# EAGLE design untitled (EAGLE 9.6.2)
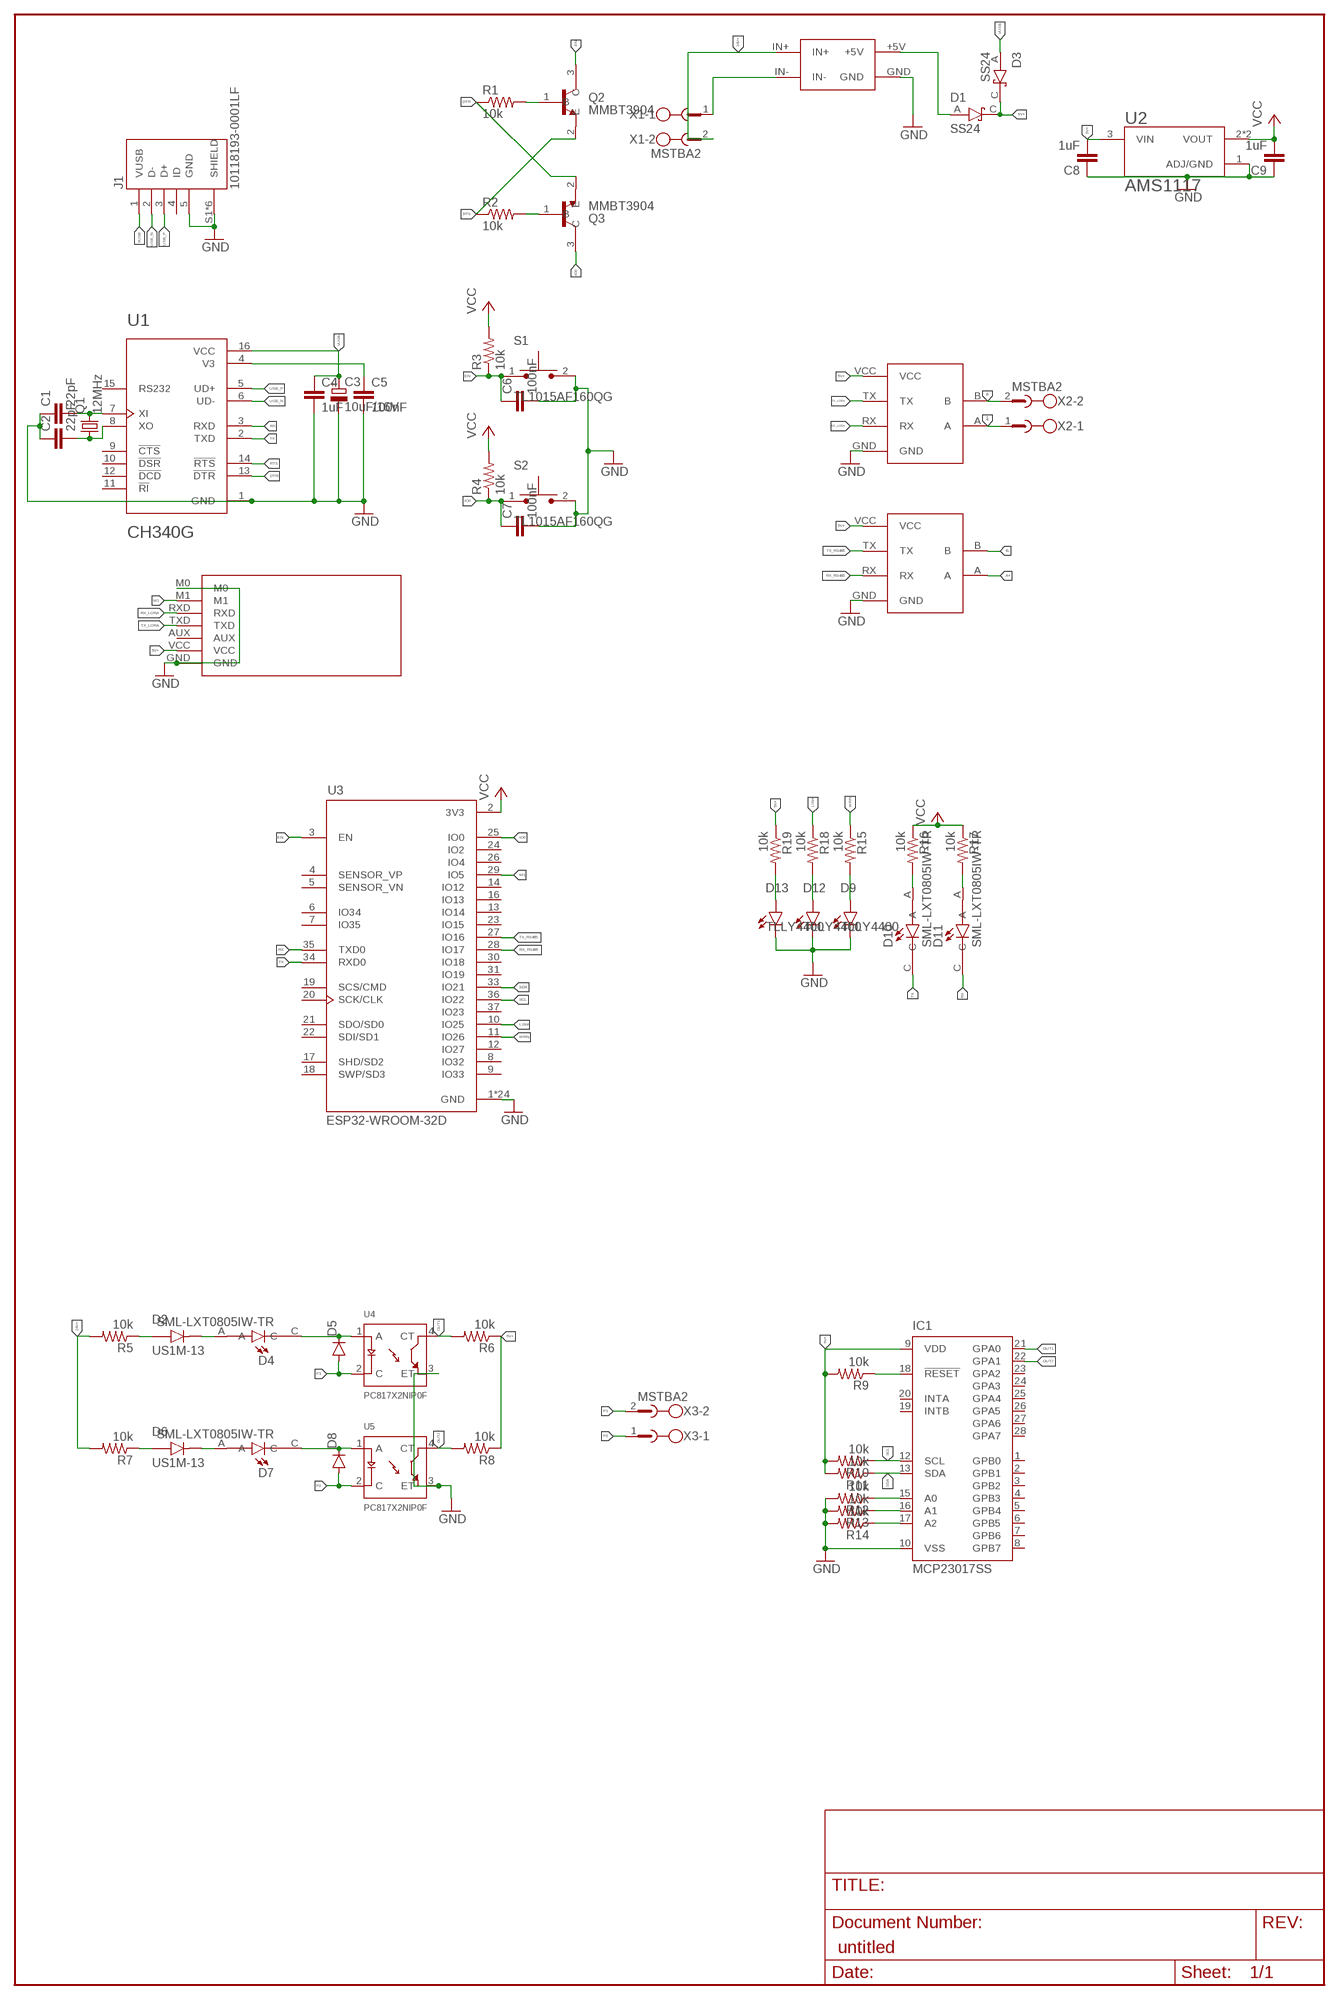
[diagram p0: schematic, sheet 1]

## Parts
C1  22pF  C-EUC0805K  [C0805K]
C2  22pF  C-EUC0805K  [C0805K]
C3  10uF/16V  CPOL-EU153CLV-0505  [153CLV-0505]
C4  1uF  C-EUC0805K  [C0805K]
C5  100nF  C-EUC0805K  [C0805K]
C6  100nF  C-EUC0805K  [C0805K]
C7  100nF  C-EUC0805K  [C0805K]
C8  1uF  C-EUC0805K  [C0805K]
C9  1uF  C-EUC0805K  [C0805K]
D1  SS24  [DIOM5336X265N]
D2  US1M-13  [DIOM5226X240N]
D3  SS24  [DIOM5336X265N]
D4  SML-LXT0805IW-TR  [LEDC2012X120N]
D5  DIODE-SOD123  [SOD123]
D6  US1M-13  [DIOM5226X240N]
D7  SML-LXT0805IW-TR  [LEDC2012X120N]
D8  DIODE-SOD123  [SOD123]
D9  TLLY4400  [LED3MM]
D10  SML-LXT0805IW-TR  [LEDC2012X120N]
D11  SML-LXT0805IW-TR  [LEDC2012X120N]
D12  TLLY4400  [LED3MM]
D13  TLLY4400  [LED3MM]
EBYTEE220-900T22D1  EBYTEE220-900T22D  [EBYTEE220-900T22D]
IC1  MCP23017SS  [SSOP28]
J1  10118193-0001LF  [FCI_10118193-0001LF]
Q1  12MHz  CRYSTALSM49  [SM49]
Q2  MMBT3904  [SOT95P240X120-3N]
Q3  MMBT3904  [SOT95P240X120-3N]
R1  10k  R-US_M0805  [M0805]
R2  10k  R-US_M0805  [M0805]
R3  10k  R-US_M0805  [M0805]
R4  10k  R-US_M0805  [M0805]
R5  10k  R-US_0207/12  [0207/12]
R6  10k  R-US_M0805  [M0805]
R7  10k  R-US_0207/12  [0207/12]
R8  10k  R-US_M0805  [M0805]
R9  10k  R-US_M0805  [M0805]
R10  10k  R-US_M0805  [M0805]
R11  10k  R-US_M0805  [M0805]
R12  10k  R-US_M0805  [M0805]
R13  10k  R-US_M0805  [M0805]
R14  10k  R-US_M0805  [M0805]
R15  10k  R-US_M0805  [M0805]
R16  10k  R-US_M0805  [M0805]
R17  10k  R-US_M0805  [M0805]
R18  10k  R-US_M0805  [M0805]
R19  10k  R-US_M0805  [M0805]
S1  TL1015AF160QG  [SW_TL1015AF160QG]
S2  TL1015AF160QG  [SW_TL1015AF160QG]
SUPER-STEPDOWN1  SUPER-STEPDOWN  [SUPER-STEPDOWN]
TTL-RS1  TTL-RS485  [TTL-RS485]
TTL-RS2  TTL-RS485  [TTL-RS485]
U1  CH340G  [SOIC127P600X180-16N]
U2  AMS1117  [SOT229P700X180-4N]
U3  ESP32-WROOM-32D  [MODULE_ESP32-WROOM-32D]
U4  PC817X2NIP0F  [SOT254P975X400-4N]
U5  PC817X2NIP0F  [SOT254P975X400-4N]
X1  MSTBA2  [MSTBA2]
X2  MSTBA2  [MSTBA2]
X3  MSTBA2  [MSTBA2]

## Nets
5V+: C8.2 D1.C(K) D3.C(K) EBYTEE220-900T22D1.VCC IC1.9(VDD) R6.1 R8.1 R9.2 R10.2 R11.2 R19.1 TTL-RS1.VCC TTL-RS2.VCC U2.3(VIN)
24V+: R5.2 R7.2 SUPER-STEPDOWN1.IN+ X1.2
A+: TTL-RS1.A TTL-RS2.A X2.1
B-: TTL-RS1.B TTL-RS2.B X2.2
DTR: Q3.2(E) R1.1 U1.13(!DTR)
EN: C6.1 Q2.3(C) R3.1 S1.1 U3.3(EN)
GND: C1.1 C2.1 C3.- C4.2 C5.2 C6.2 C7.2 C8.1 C9.1 D9.K(C) D12.K(C) D13.K(C) EBYTEE220-900T22D1.GND EBYTEE220-900T22D1.M0 IC1.10(VSS) J1.5(GND) J1.S1(SHIELD) J1.S2(SHIELD) J1.S3(SHIELD) J1.S4(SHIELD) J1.S5(SHIELD) J1.S6(SHIELD) R12.2 R13.2 R14.2 S1.2 S2.2 SUPER-STEPDOWN1.GND TTL-RS1.GND TTL-RS2.GND U1.1(GND) U2.1(ADJ/GND) U3.1(GND) U3.15(GND) U3.38(GND) U3.39_1(GND) U3.39_2(GND) U3.39_3(GND) U3.39_4(GND) U3.39_5(GND) U3.39_6(GND) U3.39_7(GND) U3.39_8(GND) U3.39_9(GND) U3.39_10(GND) U3.39_11(GND) U3.39_12(GND) U3.39_13(GND) U3.39_14(GND) U3.39_15(GND) U3.39_16(GND) U3.39_17(GND) U3.39_18(GND) U3.39_19(GND) U3.39_20(GND) U3.39_21(GND) U4.3(ET) U5.3(ET)
IO0: C7.1 Q3.3(C) R4.1 S2.1 U3.25(IO0)
LINK: R18.1 U3.10(IO25)
M1: EBYTEE220-900T22D1.M1 U3.29(IO5)
N$1: SUPER-STEPDOWN1.IN- X1.1
N$2: C5.1 U1.4(V3)
N$3: Q2.1(B) R1.2
N$4: C1.2 Q1.2 U1.7(XI)
N$5: C2.2 Q1.1 U1.8(XO)
N$6: Q3.1(B) R2.2
N$7: D10.A R16.2
N$8: D1.A SUPER-STEPDOWN1.+5V
N$9: D2.A R5.1
N$10: D2.C(K) D4.A
N$11: D4.C D5.C U4.1(A)
N$12: IC1.15(A0) R12.1
N$13: IC1.16(A1) R13.1
N$14: IC1.17(A2) R14.1
N$15: D6.A R7.1
N$16: D6.C(K) D7.A
N$17: D7.C D8.C U5.1(A)
N$18: D11.A R17.2
N$19: D13.A R19.2
N$20: IC1.18(!RESET) R9.1
N$21: D12.A R18.2
N$22: D9.A R15.2
OUT1: IC1.21(GPA0) R6.2 U4.4(CT)
OUT2: IC1.22(GPA1) R8.2 U5.4(CT)
P1: D5.A U4.2(C) X3.2
P2: D8.A U5.2(C) X3.1
RTS: Q2.2(E) R2.1 U1.14(!RTS)
RX: D11.C U1.3(RXD) U3.35(TXD0)
RX_LORA: EBYTEE220-900T22D1.RXD TTL-RS1.RX
RX_RS485: TTL-RS2.RX U3.28(IO17)
SCL: IC1.12(SCL) R10.1 U3.36(IO22)
SDA: IC1.13(SDA) R11.1 U3.33(IO21)
TX: D10.C U1.2(TXD) U3.34(RXD0)
TX_LORA: EBYTEE220-900T22D1.TXD TTL-RS1.TX
TX_RS485: TTL-RS2.TX U3.27(IO16)
USB_N: J1.2(D-) U1.6(UD-)
USB_P: J1.3(D+) U1.5(UD+)
VCC: C9.2 R3.2 R4.2 R16.1 R17.1 U2.2(VOUT) U2.4(VOUT) U3.2(3V3)
VUSB: C3.+ C4.1 D3.A J1.1(VUSB) U1.16(VCC)
WRN: R15.1 U3.11(IO26)
Unconnected: EBYTEE220-900T22D1.AUX IC1.1(GPB0) IC1.2(GPB1) IC1.3(GPB2) IC1.4(GPB3) IC1.5(GPB4) IC1.6(GPB5) IC1.7(GPB6) IC1.8(GPB7) IC1.19(INTB) IC1.20(INTA) IC1.23(GPA2) IC1.24(GPA3) IC1.25(GPA4) IC1.26(GPA5) IC1.27(GPA6) IC1.28(GPA7) J1.4(ID) U1.9(!CTS) U1.10(!DSR) U1.11(!RI) U1.12(!DCD) U1.15(RS232) U3.4(SENSOR_VP) U3.5(SENSOR_VN) U3.6(IO34) U3.7(IO35) U3.8(IO32) U3.9(IO33) U3.12(IO27) U3.13(IO14) U3.14(IO12) U3.16(IO13) U3.17(SHD/SD2) U3.18(SWP/SD3) U3.19(SCS/CMD) U3.20(SCK/CLK) U3.21(SDO/SD0) U3.22(SDI/SD1) U3.23(IO15) U3.24(IO2) U3.26(IO4) U3.30(IO18) U3.31(IO19) U3.37(IO23)

## Library data of the parts
C1 C2 C4-C9 = rcl:C-EU: CAPACITOR, European symbol; SPICEPREFIX: C
C3 = rcl:CPOL-EU: POLARIZED CAPACITOR, European symbol; SPICEPREFIX: C
D1 D3 = SS24:SS24: Diode Schottky 40V 2A Surface Mount DO-214AA (SMB) Check availability <https://pricing.snapeda.com/parts/SS24/ON%20Semiconductor/view-part?ref=eda>; AVAILABILITY: In Stock; CHECK_PRICES: https://www.snapeda.com/parts/SS24/Onsemi/view-part/?ref=eda; DESCRIPTION: Diode Schottky 40V 2A Surface Mount DO-214AA (SMB); MF: ON Semiconductor; MP: SS24; PACKAGE: DO-214AA ON Semiconductor; PRICE: None; SNAPEDA_LINK: https://www.snapeda.com/parts/SS24/Onsemi/view-part/?ref=snap
D2 D6 = US1M-13:US1M-13: Diode, Fast Recovery, 1a, 1kv, Do-214ac-2, Full Reel Check availability <https://pricing.snapeda.com/parts/US1M-13/Diodes%20Incorporated/view-part?ref=eda>; AVAILABILITY: In Stock; DESCRIPTION: Diode Standard 1000 V 1A Surface Mount SMA; MF: Diodes Incorporated; MP: US1M-13; PACKAGE: DO-214AC-214 Diodes Incorporated; PRICE: None; PURCHASE-URL: https://pricing.snapeda.com/search/part/US1M-13/?ref=eda
D4 D7 D10 D11 = SML-LXT0805IW-TR:SML-LXT0805IW-TR: LED; Luminous Intensity:11µcd; Viewing Angle:140°; Forward Current:30mA; Forward Voltage:2V; Color:Red; LED Color:Red; Leaded Process Compatible:Yes; Lens Color:White; Mounting Type:Surface Mount ;RoHS Compliant: Yes Check availability <https://pricing.snapeda.com/parts/SML-LXT0805IW-TR/Lumex%20Opto/Components/view-part?ref=eda>; AVAILABILITY: In Stock; DESCRIPTION: Red - LED Indication - Discrete 2V 0805 (2012 Metric); MF: Lumex Opto/Components; MP: SML-LXT0805IW-TR; PACKAGE: 0805 Lumex; PRICE: None; PURCHASE-URL: https://pricing.snapeda.com/search/part/SML-LXT0805IW-TR/?ref=eda
D5 D8 = diode:DIODE-: DIODE
D9 D12 D13 = led:TLLY4400: Low Current (2mA) LED 3 mm Tinted Diffused Package color YELLOW Source: Data sheet <http://www.farnell.com/datasheets/391098.pdf>; MF: VISHAY SEMICONDUCTOR; OC_FARNELL: 1612439
EBYTEE220-900T22D1 = EByte E220-900T22D:EBYTEE220-900T22D
IC1 = microchip:MCP23017: http://ww1.microchip.com/downloads/en/DeviceDoc/21952a.pdf Source: http://ww1.microchip.com/downloads/en/DeviceDoc/21952a.pdf; MF: MICROCHIP; MPN: MCP23017-E/SS; OC_FARNELL: 1467674; OC_NEWARK: 31K2960
J1 = 10118193-0001LF:10118193-0001LF: Micro USB B Type Receptacle Check availability <https://pricing.snapeda.com/parts/10118193-0001LF/FCI/view-part?ref=eda>; AVAILABILITY: In Stock; DESCRIPTION: USB - micro B USB 2.0 Receptacle Connector 5 Position Surface Mount, Right Angle; Through Hole; MF: FCI; MP: 10118193-0001LF; PACKAGE: None; PRICE: None; PURCHASE-URL: https://pricing.snapeda.com/search/part/10118193-0001LF/?ref=eda
Q1 = crystal:CRYSTAL: CRYSTAL; OC_FARNELL: unknown; OC_NEWARK: unknown
Q2 Q3 = MMBT3904:MMBT3904: MMBT3904 Series 40 V CE Breakdown 0.2 A NPN General Purpose Amplifier - SOT-23 Check availability <https://pricing.snapeda.com/parts/MMBT3904/ON%20Semiconductor/view-part?ref=eda>; AVAILABILITY: In Stock; DESCRIPTION: Bipolar (BJT) Transistor NPN 40 V 200 mA 300MHz 300 mW Surface Mount SOT-23-3 (TO-236); MF: ON Semiconductor; MP: MMBT3904; PACKAGE: SOT-23-3 Motorola; PRICE: None
R1-R4 R6 R8-R19 = rcl:R-US_: RESISTOR, American symbol; SPICEPREFIX: R
R5 R7 = adafruit:R-US_: RESISTOR, American symbol
S1 S2 = TL1015AF160QG:TL1015AF160QG: Tactile Switch SPST-NO Top Actuated Surface Mount Check availability <https://pricing.snapeda.com/parts/TL1015AF160QG/E-Switch/view-part?ref=eda>; AVAILABILITY: In Stock; DESCRIPTION: Tactile Switch SPST-NO Top Actuated Surface Mount; MF: E-Switch; MP: TL1015AF160QG; PACKAGE: None; PRICE: None; PURCHASE-URL: https://pricing.snapeda.com/search/part/TL1015AF160QG/?ref=eda
SUPER-STEPDOWN1 = SUPER-STEPDOWN:SUPER-STEPDOWN
TTL-RS1 TTL-RS2 = TTL-RS485:TTL-RS485
U1 = CH340G:CH340G: Check availability <https://pricing.snapeda.com/parts/Ch340G/WCH/view-part?ref=eda>; AVAILABILITY: Not in stock; DESCRIPTION: USB Interface Integrated Circuit; MF: WCH; MP: Ch340G; PACKAGE: None; PRICE: None
U2 = AMS1117:AMS1117: Sot223/Pkg 1-Amp 5-Volt Low Drop Out Voltage Regulatator Check availability <https://pricing.snapeda.com/parts/AMS1117/Advanced%20Monolithic%20Systems/view-part?ref=eda>; AVAILABILITY: Not in stock; DESCRIPTION: 1A LOW DROPOUT VOLTAGE REGULATOR SOT-223; MF: Advanced Monolithic Systems; MP: AMS1117; PACKAGE: SOT-223 Seeed Technology; PRICE: None
U3 = ESP32-WROOM-32D:ESP32-WROOM-32D: Bluetooth, WiFi 802.11b/g/n, Bluetooth v4.2 + EDR, Class 1, 2 and 3 Transceiver Module 2.4GHz ~ 2.5GHz Integrated, Trace Surface Mount Check availability <https://pricing.snapeda.com/parts/ESP32-WROOM-32D/Espressif%20Systems/view-part?ref=eda>; AVAILABILITY: In Stock; DESCRIPTION: Bluetooth, WiFi 802.11b/g/n, Bluetooth v4.2 +EDR, Class 1, 2 and 3 Transceiver Module 2.4GHz ~ 2.5GHz Integrated; MF: Espressif Systems; MP: ESP32-WROOM-32D; PACKAGE: Module Espressif Systems; PRICE: None; PURCHASE-URL: https://pricing.snapeda.com/search/part/ESP32-WROOM-32D/?ref=eda
U4 U5 = PC817X2NIP0F:PC817X2NIP0F: PC817 Series 1 Channel 80 V 5000 Vrms General Purpose Photocoupler - DIP-4 Check availability <https://pricing.snapeda.com/parts/PC817X2NIP0F/Sharp%20Microelectronics/view-part?ref=eda>; AVAILABILITY: Not in stock; DESCRIPTION: Optoisolator Transistor Output 5000Vrms 1 Channel 4-SMD; MF: Sharp Microelectronics; MP: PC817X2NIP0F; PACKAGE: SMD-4 Sharp Microelectronics; PRICE: None
X1-X3 = con-phoenix-508:MSTBA2: PHOENIX; MF: FARNELL; MPN: 1757242; OC_FARNELL: 3705171; OC_NEWARK: 71C4161

## Board
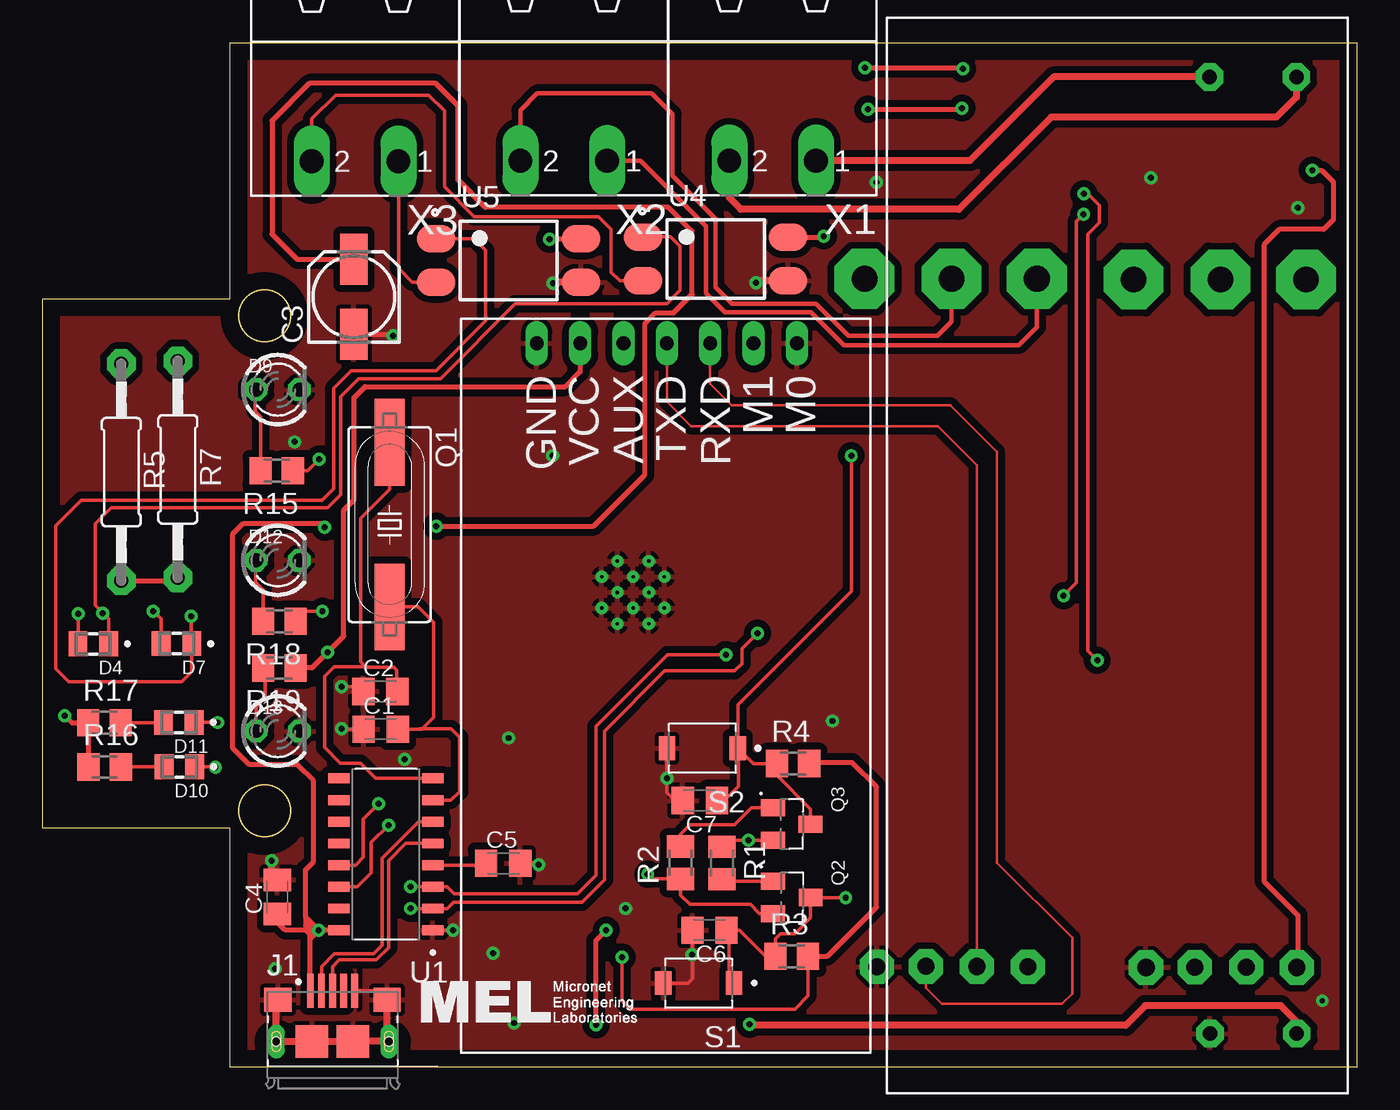
[diagram p1: board, top side]
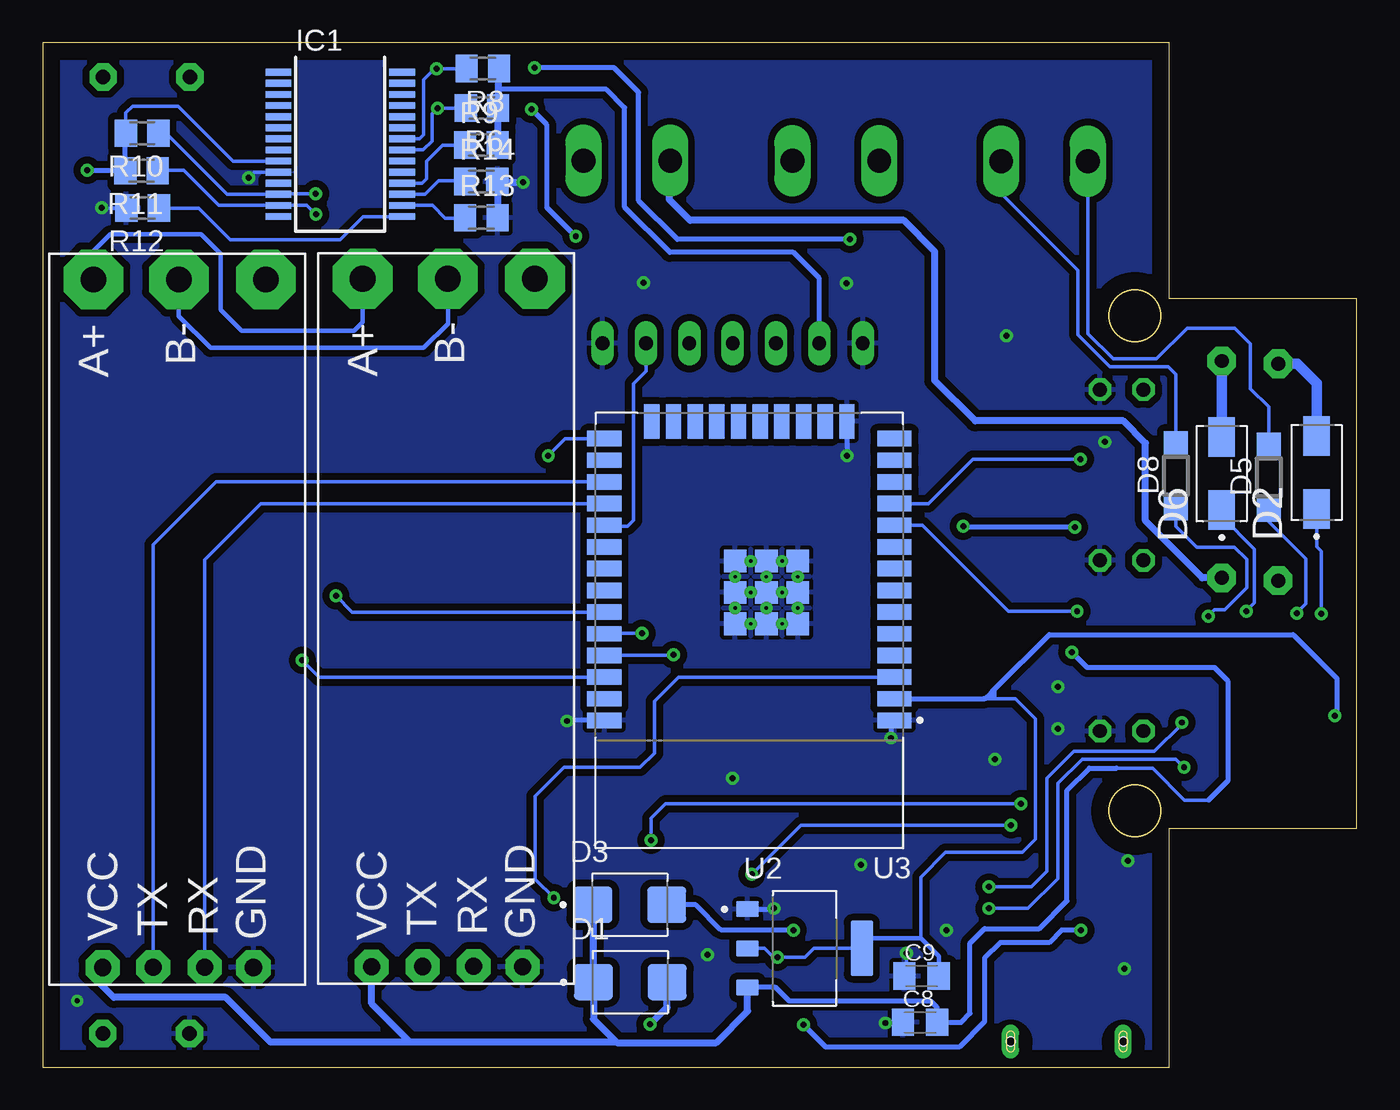
[diagram p2: board, bottom side, seen from below]

Size 77 x 60 mm. Coordinates in mm from the lower left corner, seen from the top.
Outline: 11,60 77,60 77,0 11,0 11,14 0,14 0,45 11,45 11,60
Outline: circle at 13,44 radius 1.5
Outline: circle at 13,15 radius 1.5
Copper layers (1*16): Top 0.035mm / dielectric 1.5mm / Bottom 0.035mm
Design rules "default": minimum track width 6mil, minimum drill 0.35mm, track to track 6mil, track to pad 6mil, pad to pad 6mil, via to via 6mil, smd to smd 6mil, copper to edge 40mil, drill to drill 6mil, minimum pad ring 10mil, minimum via ring 8mil, stop-mask expansion 4mil, vias tented up to drill 0mil, thermal gap 10mil

### Footprints (pad centres in the part's own frame; a part is rotated, then mirrored left to right if it is on the bottom)
C0805K = smd 1.3 x 1.6: 1 -1,0; 2 1,0
153CLV-0505 = smd 3 x 1.6: + 2.2,0; - -2.2,0
DIOM5336X265N = smd 2.29 x 2.12: A 2.16,0; C -2.16,0
DIOM5226X240N = smd 2.33 x 1.55: A 2.135,0; C -2.135,0
LEDC2012X120N = smd 1.1 x 1.45: A 0.9,0; C -0.9,0
SOD123 = smd 1.4 x 1.4: A 1.9,0; C -1.9,0
LED3MM = drill 0.813 octagon: A -1.27,0; K 1.27,0
EBYTEE220-900T22D = drill 0.8 pad 1.27 long: AUX -4.56,-10.98; GND -4.56,-16.06; M0 -4.56,-0.82; M1 -4.56,-3.36; RXD -4.56,-5.9; TXD -4.56,-8.44; VCC -4.56,-13.52
SSOP28 = smd 0.4 x 1.5: 1 -4.225,-3.625; 2 -3.575,-3.625; 3 -2.925,-3.625; 4 -2.275,-3.625; 5 -1.625,-3.625; 6 -0.975,-3.625; 7 -0.325,-3.625; 8 0.325,-3.625; 9 0.975,-3.625; 10 1.625,-3.625; 11 2.275,-3.625; 12 2.925,-3.625; 13 3.575,-3.625; 14 4.225,-3.625; 15 4.225,3.625; 16 3.575,3.625; 17 2.925,3.625; 18 2.275,3.625; 19 1.625,3.625; 20 0.975,3.625; 21 0.325,3.625; 22 -0.325,3.625; 23 -0.975,3.625; 24 -1.625,3.625; 25 -2.275,3.625; 26 -2.925,3.625; 27 -3.575,3.625; 28 -4.225,3.625
FCI_10118193-0001LF = smd 0.4 x 2: 1 -1.3,2.975; 2 -0.65,2.975; 3 0,2.975; 4 0.65,2.975; 5 1.3,2.975 | smd 1.6 x 1.4: S1 -3.2,2.45; S2 3.2,2.45 | smd 1.9 x 1.9: S3 1.2,0; S4 -1.2,0 | drill 0.5 pad 0.9 long: S5 -3.3,0; S6 3.3,0 | hole 0.5: -3.3,0; 3.3,0
SM49 = smd 5.08 x 1.778: 1 -4.826,0; 2 4.826,0
SOT95P240X120-3N = smd 1 x 1.4: 1 -0.95,-1.1; 2 0.95,-1.1; 3 0,1.1
M0805 = smd 1.3 x 1.6: 1 -0.95,0; 2 0.95,0
0207/12 = drill 0.813 pad 1.676 octagon: 1 -6.35,0; 2 6.35,0
SW_TL1015AF160QG = smd 0.95 x 1.4: 1 -2.075,0; 2 2.075,0
SUPER-STEPDOWN = drill 0.85 pad 1.6 octagon: +5V 59.509,24.006; GND 59.509,18.926; IN+ 3.478,23.979; IN- 3.478,18.899
TTL-RS485 = drill 1.5 pad 3.5 octagon: A -19.7,-6; B -19.7,-1; P$7 -19.7,4.1 | drill 1 pad 2 octagon: GND 20.6,3.37; RX 20.581,0.505; TX 20.583,-2.493; VCC 20.6,-5.47
SOIC127P600X180-16N = smd 1.31 x 0.62: 1 -2.75,4.445; 2 -2.75,3.175; 3 -2.75,1.905; 4 -2.75,0.635; 5 -2.75,-0.635; 6 -2.75,-1.905; 7 -2.75,-3.175; 8 -2.75,-4.445; 9 2.75,-4.445; 10 2.75,-3.175; 11 2.75,-1.905; 12 2.75,-0.635; 13 2.75,0.635; 14 2.75,1.905; 15 2.75,3.175; 16 2.75,4.445
SOT229P700X180-4N = smd 1.31 x 0.93: 1 -3.345,2.29; 2 -3.345,0; 3 -3.345,-2.29 | smd 1.31 x 3.24: 4 3.345,0
MODULE_ESP32-WROOM-32D = smd 2 x 0.9: 1 -8.5,5.26; 2 -8.5,3.99; 3 -8.5,2.72; 4 -8.5,1.45; 5 -8.5,0.18; 6 -8.5,-1.09; 7 -8.5,-2.36; 8 -8.5,-3.63; 9 -8.5,-4.9; 10 -8.5,-6.17; 11 -8.5,-7.44; 12 -8.5,-8.71; 13 -8.5,-9.98; 14 -8.5,-11.25; 25 8.5,-11.25; 26 8.5,-9.98; 27 8.5,-8.71; 28 8.5,-7.44; 29 8.5,-6.17; 30 8.5,-4.9; 31 8.5,-3.63; 32 8.5,-2.36; 33 8.5,-1.09; 34 8.5,0.18; 35 8.5,1.45; 36 8.5,2.72; 37 8.5,3.99; 38 8.5,5.26 | smd 0.9 x 2: 15 -5.715,-12.25; 16 -4.445,-12.25; 17 -3.175,-12.25; 18 -1.905,-12.25; 19 -0.635,-12.25; 20 0.635,-12.25; 21 1.905,-12.25; 22 3.175,-12.25; 23 4.445,-12.25; 24 5.715,-12.25 | smd 1.33 x 1.33: 39_1 -2.835,-0.405; 39_2 -1,-0.405; 39_3 0.835,-0.405; 39_4 -2.835,-2.24; 39_5 -1,-2.24; 39_6 0.835,-2.24; 39_7 -2.835,-4.075; 39_8 -1,-4.075; 39_9 0.835,-4.075 | drill 0.2 pad 0.3: 39_10 -1.917,-0.405; 39_11 -0.083,-0.405; 39_12 -2.835,-1.323; 39_13 -1,-1.323; 39_14 0.835,-1.323; 39_15 -1.917,-2.24; 39_16 -0.083,-2.24; 39_17 -2.835,-3.158; 39_18 -1,-3.158; 39_19 0.835,-3.158; 39_20 -1.917,-4.075; 39_21 -0.083,-4.075
SOT254P975X400-4N = smd 2.25 x 1.6: 1 -4.25,1.27; 2 -4.25,-1.27; 3 4.25,-1.27; 4 4.25,1.27
MSTBA2 = drill 1.397 long: 1 -2.54,5.08; 2 2.54,5.08

### Placement (x,y rotation side)
C1  19.81,19.79 0 top
C2  19.79,22 0 top
C3  18.23,45.12 90 top
C4  13.75,9.96 90 top
C5  26.98,11.94 0 top
C6  39.07,8.02 180 top
C7  38.5,15.61 180 top
C8  25.59,2.62 0 bottom
C9  25.5,5.33 0 bottom
D1  42.57,4.98 0 bottom
D2  2.36,34.83 90 bottom
D3  42.6,9.51 0 bottom
D4  2.96,24.79 180 top
D5  5.17,34.55 90 bottom
D6  7.92,34.76 90 bottom
D7  7.84,24.8 180 top
D8  10.61,34.64 90 bottom
D9  13.78,39.68 0 top
D10  8.01,17.59 180 top
D11  7.98,20.19 180 top
D12  13.78,29.68 0 top
D13  13.78,19.68 0 top
EBYTEE220-900T22D1  45.01,37.83 270 top
IC1  59.57,54.04 270 bottom
J1  16.98,1.5 0 top
Q1  20.33,31.77 270 top
Q2  43.9,9.93 270 top
Q3  43.89,14.23 270 top
R1  39.8,11.95 270 top
R2  37.38,11.97 90 top
R3  43.89,6.49 0 top
R4  43.97,17.78 0 top
R5  4.61,34.84 270 top
R6  51.26,56.17 180 bottom
R7  7.92,35.01 270 top
R8  51.21,58.48 180 bottom
R9  51.29,54 0 bottom
R10  71.17,54.69 180 bottom
R11  71.2,52.5 180 bottom
R12  71.14,50.31 180 bottom
R13  51.3,49.74 0 bottom
R14  51.31,51.86 0 bottom
R15  13.72,34.93 180 top
R16  3.64,17.58 0 top
R17  3.63,20.17 0 top
R18  13.87,26.11 180 top
R19  13.88,23.38 180 top
S1  38.44,4.92 180 top
S2  38.66,18.68 180 top
SUPER-STEPDOWN1  49.47,61.47 270 top
TTL-RS1  52.25,26.47 270 bottom
TTL-RS2  68.02,26.43 270 bottom
U1  20.11,12.46 180 top
U2  32.35,6.96 0 bottom
U3  35.59,25.56 180 bottom
U4  39.43,47.32 0 top
U5  27.3,47.25 0 top
X1  42.77,58.17 180 top
X2  30.53,58.16 180 top
X3  18.3,58.14 180 top

### Tracks (layer width: path | path; a pad name or v marks a point on that pad's centre or on a via)
5V+  (via drill 0.35)
  Top 0.305: R19.1 15.78,23.38 v16.7,24.3 17.64,25.24 17.64,32.62 18.25,33.23 18.25,39.22 18.88,39.85 30.63,39.85 31.49,40.72 EBYTEE220-900T22D1.VCC | v74.38,52.53 74.94,52.53 75.61,51.86 75.61,49.63 75.05,49.07 72.47,49.07 71.56,48.16 71.56,10.89 73.54,8.91 73.54,5.89 TTL-RS2.VCC
  Bottom 0.203: IC1.9 65.83,53.07 69.05,56.29 71.72,56.29 72.12,55.88 R10.2 | 14.06,17.51 11.97,17.51 10.1,15.64 8.7,15.64
  Bottom 0.254: 35.66,4.54 35.7,4.5
  Bottom 0.305: R10.2 72.15,54.66 R11.2 74.37,52.5 74.39,52.52 | 14.06,17.51 15.68,17.51 16.98,16.21 16.98,9.74 18.6,8.11 21.81,8.11 22.66,7.26 22.66,3.14 23.18,2.62 C8.2 24.59,3.49 24.96,3.87 33.25,3.87 34.06,4.67 35.52,4.67 35.66,4.54 | 8.7,15.64 7.54,16.8 7.54,22.59 8.33,23.39 15.79,23.39 v16.7,24.3 | EBYTEE220-900T22D1.VCC 31.49,46.19 33.02,47.72 40.25,47.72 42.9,50.37 42.9,56.2 43.96,57.26 50.16,57.26 50.31,57.11 | 74.39,52.52 | 74.39,52.52 v74.38,52.53
  Bottom 0.406: R8.1 50.31,58.43 50.31,57.11 R6.1 50.34,56.14 R9.2 | D3.C 44.73,9.48 D1.C 44.73,2.81 43.43,1.51 43.39,1.47 | 43.39,1.47 43.36,1.44 37.53,1.44 35.7,3.27 35.7,4.5 U2.3 | 43.39,1.47 55.48,1.47 | TTL-RS1.VCC 57.72,3.71 55.48,1.47 | 55.48,1.47 | 55.48,1.47 63.65,1.47 66.27,4.08 72.83,4.08 73.57,4.82 73.57,5.75 TTL-RS2.VCC
24V+
  Top 0.305: R5.2 7.76,28.49 R7.2
  Top 0.406: SUPER-STEPDOWN1.IN+ 73.45,56.8 72.29,55.63 59.09,55.63 53.69,50.23 40.91,50.23 40.23,50.92 X1.2
  Bottom 0.406: R7.2 9.06,28.66 12.39,31.99 12.39,36.55 13.69,37.84 22.36,37.84 24.73,40.21 24.73,47.77 26.55,49.59 39.07,49.59 40.28,50.8 40.28,53.04 X1.2
A+
  Top 0.254: TTL-RS1.A 58.25,43.34 57.19,42.28 46.95,42.28 45.02,44.2 39.99,44.2 38.86,45.33 38.86,49.26 35.04,53.08 X2.1
  Bottom 0.254: TTL-RS1.A 58.25,43.62 58.74,43.14 65.33,43.14 66.56,44.37 66.56,47.63 67.7,48.77 73.04,48.77 74.02,47.79 TTL-RS2.A
B-
  Top 0.254: TTL-RS1.B 53.25,43.65 52.42,42.82 47.21,42.82 45.31,44.72 40.39,44.72 39.43,45.69 39.43,49.68 36.91,52.21 36.91,55.81 35.69,57.03 28.97,57.03 27.99,56.05 X2.2
  Bottom 0.254: TTL-RS1.B 53.25,43.54 54.67,42.12 67.16,42.12 69.02,43.99 TTL-RS2.B
DTR  (via drill 0.35)
  Top 0.203: R1.1 40.18,13.28 v41.36,13.28 Q3.2 | U1.13 18.33,11.83 18.79,12.28 18.79,14.53 v19.69,15.43
  Bottom 0.203: v19.69,15.43 40.5,15.43 41.36,14.57 v41.36,13.28
EN  (via drill 0.35)
  Top 0.203: 40.2,8.02 40.82,8.02 42.35,6.49 R3.1 42.94,7.53 43.23,7.82 44.07,7.82 45,8.76 Q2.3 45.02,9.91 v47.05,9.91 | 40.2,8.02 C6.1 | S1.1 40.2,5.24 40.2,8.02
  Bottom 0.203: U3.3 39.74,22.84 41.16,21.42 41.16,18.39 41.99,17.56 46.45,17.56 48.15,15.87 48.15,11 v47.05,9.91
GND  (via drill 0.3, 0.35)
  Top 0.203: S2.2 v36.58,16.91 36.58,16.06 37.03,15.61 C7.2 | C6.2 38.07,6.6 v38.05,6.58 38.08,6.54 38.08,5.19 37.82,4.92 S1.2 | C1.1 17.56,19.79 v17.53,19.82 | C2.1 18.52,22.27 v17.53,22.27 | U1.1 24.04,8.02 v24.05,8 | J1.5 19.66,4.47 J1.S2
  Top 0.305: C5.2 28.99,11.94 v29.07,11.86 | C3.- 20.44,42.92 v20.53,42.83
  Top 0.406: U5.3 29.92,45.98 29.88,45.94 v29.91,45.92 | U4.3 41.87,46.05 41.77,45.95 v41.79,45.94 | v41.79,45.94 | C4.2 13.41,11.31 v13.41,12.09 | J1.S2 20.18,1.6 J1.S6 J1.S3 J1.S4 J1.S5 13.68,3.85 J1.S1
  Bottom 0.203: IC1.10 64.62,52.42 v64.94,52.1 | R12.2 v73.52,50.31 v73.53,50.32 | C8.1 27.58,2.62 v27.62,2.58 | C9.1 26.4,5.43 v26.4,6.66
  Bottom 0.305: U3.38 46.25,20.3 v46.28,20.27 | U3.39_17 U3.39_7 U3.39_20 | U3.39_8 U3.39_18 U3.39_5 34.64,27.8 | U3.39_9 U3.39_19 U3.39_6 U3.39_14 U3.39_3 U3.39_11 U3.39_2 | U3.39_16 34.64,27.8 | U3.39_4 U3.39_12 U3.39_1 U3.39_10 U3.39_2 | 34.64,27.8 34.59,27.76 U3.39_13 U3.39_2 | U3.1 27.29,20.11 v27.29,19.27 | U3.15 v29.88,35.8 v29.87,35.8 | U2.1 34.18,9.25 v34.14,9.29
  Bottom 0.406: R13.2 R14.2 50.32,51.82 v48.86,51.82
  other vias: 74.97,3.88 13.63,5.76 14.77,36.61 21.22,18.03
  pour Top (isolate 0.406): 11.14,60.03 77.14,60.03 77.14,0.03 11.14,0.03 11.14,14.03 0.14,14.03 0.14,45.03 11.14,45.03
  pour Bottom (isolate 0.406): 11.14,60.03 77.14,60.03 77.14,0.03 11.14,0.03 11.14,14.03 0.14,14.03 0.14,45.03 11.14,45.03
IO0  (via drill 0.35)
  Top 0.203: S2.1 41.64,17.78 R4.1 43.02,17.08 44.99,15.11 Q3.3 | C7.1 39.92,15.61 40.76,16.45 40.76,18.65 S2.1 | v47.37,35.82 47.37,27.87 40.73,21.23 S2.1
  Bottom 0.203: U3.25 46.38,36.81 v47.37,35.82
LINK  (via drill 0.35)
  Top 0.203: R18.1 15.4,26.69 v16.39,26.69
  Bottom 0.203: v16.39,26.69 20.42,26.69 25.46,31.73 U3.10
M1
  Bottom 0.203: EBYTEE220-900T22D1.M1 41.65,40.76 42.38,40.03 42.38,32.04 42.72,31.69 44.05,31.69 U3.29
N$1
  Top 0.406: SUPER-STEPDOWN1.IN- 59.24,57.99 54.33,53.09 X1.1
N$2
  Top 0.203: U1.4 25.87,11.83 C5.1
N$3
  Top 0.203: R1.2 39.92,10.88 Q2.1
N$4
  Top 0.203: Q1.2 22.01,26.95 22.9,26.06 22.9,20.49 22.2,19.79 22.04,19.79 | 22.04,19.79 C1.2 | U1.7 23.91,15.64 24.42,16.14 24.42,19.33 23.94,19.81 22.05,19.81 22.04,19.79
N$5
  Top 0.203: Q1.1 20.33,33.84 18.63,32.14 18.63,23.73 18.95,23.41 19.1,23.41 | 19.1,23.41 20.59,23.41 20.75,23.25 20.75,22.04 C2.2 | 19.1,23.41 19.05,23.46 17.08,23.46 16.51,22.88 16.51,18.72 17.42,17.81 18.62,17.81 19.52,16.91 U1.8
N$6
  Top 0.203: R2.2 37.38,13.63 37.94,14.19 40.53,14.19 41.53,15.2 42.77,15.2 Q3.1
N$7
  Top 0.203: R16.2 7.1,17.58 D10.A
N$8  (via drill 0.35)
  Top 0.406: SUPER-STEPDOWN1.+5V 73.48,2.66 72.55,3.6 64.61,3.6 63.46,2.45 41.46,2.45 v41.41,2.5
  Bottom 0.406: v41.41,2.5 40.41,3.5 D1.A
N$9
  Bottom 0.61: D2.A 2.36,40.05 3.5,41.19 R5.1
N$10  (via drill 0.35)
  Top 0.203: v2.08,26.55 2.08,24.81 D4.A
  Bottom 0.203: D2.C 2.36,30.48 2.08,30.21 v2.08,26.55
N$11  (via drill 0.35)
  Top 0.203: D4.C 3.86,26.25 v3.52,26.59 3.07,27.04 3.07,31.82 4.01,32.76 16.69,32.76 17.46,33.52 17.46,39.27 18.52,40.33 23.31,40.33 27.69,44.71 36.57,44.71 37.35,45.49 37.35,48.07 36.8,48.62 35.21,48.62 U4.1
  Bottom 0.203: D5.C 5.17,31.95 2.99,29.77 2.99,27.13 v3.52,26.59
N$12
  Bottom 0.203: IC1.15 58.23,49.82 59.58,48.47 66.02,48.47 67.87,50.31 R12.1
N$13
  Bottom 0.203: IC1.16 54.17,50.47 53.42,49.72 52.27,49.72 R13.1
N$14
  Bottom 0.203: IC1.17 54.6,51.12 53.82,51.9 52.3,51.9 R14.1
N$15
  Bottom 0.61: D6.A R7.1
N$16  (via drill 0.35)
  Top 0.203: v6.49,26.71 6.94,26.25 D7.A
  Bottom 0.203: D6.C 7.92,32.25 6.01,30.34 6.01,27.18 v6.49,26.71
N$17  (via drill 0.35)
  Top 0.203: v8.71,26.41 8.71,24.83 D7.C 8.74,23.16 8.14,22.55 1.54,22.55 0.77,23.32 0.77,31.72 2.25,33.2 16.39,33.2 17.05,33.86 17.05,39.77 18.08,40.8 23.06,40.8 25.96,43.7 25.96,47.83 25.27,48.52 U5.1
  Bottom 0.203: D8.C 10.61,31.68 9.38,30.46 7.17,30.46 6.45,29.74 6.45,28.08 7.74,26.79 8.34,26.79 v8.71,26.41
N$18
  Top 0.203: R17.2 7.07,20.17 D11.A
N$19
  Top 0.203: D13.A 12.51,21.1 13.04,21.63 13.04,23.26 R19.2
N$20
  Bottom 0.203: IC1.18 54.77,51.77 54.5,52.04 54.5,53.06 53.56,54 R9.1
N$21
  Top 0.203: R18.2 12.92,27.96 12.49,28.39 12.49,29.66 D12.A
N$22
  Top 0.203: R15.2 12.77,38.08 12.44,38.4 12.44,39.62 D9.A
OUT1  (via drill 0.35)
  Top 0.305: v45.76,48.67 45.68,48.59 U4.4 | v48.35,56.09 53.83,56.09 53.86,56.13 v53.86,56.17
  Bottom 0.203: IC1.21 54.71,53.72 54.19,54.24 54.19,55.84 v53.86,56.17 R6.2
  Bottom 0.305: v45.76,48.67 45.79,48.67 47.45,50.33 47.45,55.19 v48.35,56.09
OUT2  (via drill 0.35)
  Top 0.305: U5.4 31.51,48.48 v29.7,48.48 | v48.17,58.53 53.83,58.53 53.89,58.47 53.9,58.47 v53.91,58.48
  Bottom 0.203: IC1.22 54.92,54.37 54.68,54.61 54.68,57.82 54.02,58.48 v53.91,58.48 R8.2
  Bottom 0.305: v29.7,48.48 39.81,48.48 42.09,50.75 42.09,57.09 43.53,58.53 v48.17,58.53
P1
  Top 0.203: 15.72,53.02 X3.2 15.76,55.54 17.15,56.93 22.63,56.93 23.55,56.01 23.55,51.55 25.29,49.81 32.58,49.81 33.32,49.08 33.32,46.56 33.83,46.05 U4.2
  Bottom 0.203: D5.A 5.17,38.67 6.23,39.74 6.23,42.36 7.15,43.27 9.94,43.27 11.73,41.48 14.27,41.48 15.76,42.97 X3.2
P2
  Top 0.203: U5.2 21.64,45.98 20.84,46.78 X3.1
  Bottom 0.203: D8.A 10.61,40.59 11.03,41.02 14.48,41.02 16.34,42.88 16.34,46.67 20.84,51.17 X3.1
RTS  (via drill 0.35)
  Top 0.203: Q2.2 42,8.98 41.46,9.52 37.92,9.52 37.38,10.07 R2.1 35.73,11.02 v35.45,11.3 | U1.14 18.43,10.56 19.25,11.37 19.25,13.16 v20.26,14.17
  Bottom 0.203: v20.26,14.17 32.58,14.17 v35.45,11.3
RX  (via drill 0.35)
  Top 0.203: v21.55,10.55 U1.3 23.7,10.56 24.09,10.16 31.34,10.16 32.41,11.24 32.41,19.96 36.62,24.16 v40.04,24.16 | v10.25,20.18 D11.C
  Bottom 0.203: v21.55,10.55 19.08,10.55 18.15,11.48 18.15,16.92 16.58,18.49 11.86,18.49 10.25,20.09 v10.25,20.18 | v40.04,24.16 40.08,24.11 U3.35
RX_LORA
  Top 0.152: EBYTEE220-900T22D1.RXD 39.11,40.01 40.35,38.78 53.19,38.78 55.92,36.04 55.92,11.98 60.33,7.57 60.33,4.31 59.73,3.71 52.69,3.71 51.75,4.65 TTL-RS1.RX
RX_RS485
  Bottom 0.203: TTL-RS2.RX 67.52,29.71 64.22,33 U3.28
SCL  (via drill 0.35)
  Top 0.203: v61.01,51.15 61.23,51.15 61.9,50.48 61.9,49.44 61.23,48.77 61.23,24.39 v61.79,23.84
  Bottom 0.203: R10.1 69.77,54.69 66.2,51.12 IC1.12 63.16,51.15 v61.01,51.15 | U3.36 60.8,22.84 v61.79,23.84
SDA  (via drill 0.35)
  Top 0.203: v59.82,27.61 60.58,28.37 60.58,49.54 v60.99,49.95
  Bottom 0.203: R11.1 70.23,52.52 68.74,52.52 66.68,50.47 IC1.13 61.53,50.47 60.96,49.91 60.96,49.92 v60.99,49.95 | U3.33 58.86,26.65 v59.82,27.61
TX  (via drill 0.35)
  Top 0.203: v21.55,9.29 U1.2 23.69,9.29 24.07,9.66 31.6,9.66 32.92,10.98 32.92,19.68 36.44,23.2 40.55,23.2 40.98,23.63 40.98,24.51 v41.89,25.41 | D10.C 10.1,17.59 v10.12,17.57
  Bottom 0.203: v21.55,9.29 19.27,9.29 17.52,11.04 17.52,16.61 16.09,18.04 10.6,18.04 v10.12,17.57 | v41.89,25.41 44.06,25.41 U3.34
TX_LORA
  Top 0.152: EBYTEE220-900T22D1.TXD 36.57,38.96 37.99,37.54 52.45,37.54 54.75,35.25 TTL-RS1.TX
TX_RS485
  Bottom 0.203: TTL-RS2.TX 70.51,30.59 66.83,34.27 U3.27
USB_N
  Top 0.203: J1.2 16.33,5.88 17.09,6.64 19.4,6.64 19.89,7.13 19.89,12.23 22.03,14.37 U1.6
USB_P
  Top 0.203: J1.3 16.98,5.88 17.38,6.28 19.54,6.28 20.26,6.99 20.26,12.09 21.28,13.11 22.84,13.11 U1.5
VCC  (via drill 0.35)
  Top 0.203: v33.96,6.44 33.96,3.89 34.45,3.4 44.08,3.4 44.85,4.17 R3.2
  Top 0.305: R16.1 2.69,20.16 | 2.69,20.16 R17.1 | v1.3,20.59 1.73,20.16 2.69,20.16 | R3.2 45.97,6.49 48.85,9.37 48.85,16.41 47.43,17.83 44.97,17.83 R4.2
  Bottom 0.203: U2.4 31.81,6.96 32.34,6.44 v33.96,6.44 34.18,6.44 34.7,6.96 U2.2 | 25.54,7.53 25.54,11.13 24.09,12.57 19.6,12.57 18.84,13.34 18.84,20.4 20.01,21.57 21.15,21.57 | 21.15,21.57 21.4,21.57 | 21.4,21.57 21.85,21.57 | 21.15,21.57 21.19,21.61 21.19,21.78 | 21.19,21.78 21.19,22.16 | 21.19,21.78 21.4,21.57 | 21.4,21.57 21.42,21.59 21.42,21.78 | 21.42,21.78 21.42,21.93 | 21.35,22 21.35,21.86 21.42,21.78
  Bottom 0.254: C9.2 24.5,6.5 25.54,7.53 28.99,7.53 29.52,7 29.48,6.96 U2.4
  Bottom 0.305: U3.2 21.85,21.57 21.78,21.57 21.42,21.93 21.35,22 21.19,22.16 18.02,25.33 3.73,25.33 1.17,22.77 1.17,20.59 v1.3,20.59
VUSB  (via drill 0.35)
  Top 0.305: J1.1 15.68,7.53 | U1.16 v16.17,8.02 | 15.68,7.53 v16.17,8.02 | v16.17,8.02 15.52,8.02 | 15.45,8.02 14.22,8.02 13.75,8.48 C4.1 | v32.42,2.48 32.42,7.41 v33.02,8.01 | v16.17,8.02 15.84,8.34 | 15.84,8.34 15.4,8.78 | 15.4,8.78 15.4,11.56 15.87,12.03 15.87,16.77 14.92,17.72 12.1,17.72 11.14,18.68 11.14,31.23 11.76,31.85 16.3,31.85 v16.53,31.61 | v23.07,31.68 32.28,31.68 35.28,34.68 35.28,43.54 35.92,44.17 36.96,44.17 38.06,45.26 38.06,48.97 36.67,50.36 25.93,50.36 24.33,51.96 24.33,56.32 23.03,57.62 15.62,57.62 13.43,55.43 13.43,48.79 14.92,47.31 18.22,47.31 C3.+ | 15.4,8.78 15.4,8.28 | 15.4,8.28 15.4,8.06 15.45,8.02 | 15.4,8.28 15.47,8.34 15.84,8.34 | 15.45,8.02 15.52,8.02 | 15.52,8.02 15.84,8.34 | 15.68,7.53 15.68,7.78 15.45,8.02
  Bottom 0.305: v16.17,8.02 17.3,8.02 18.03,7.29 20.89,7.29 21.81,6.38 21.81,2.66 23.3,1.17 31.11,1.17 v32.42,2.48 | v33.02,8.01 33.06,8.05 37.28,8.05 38.73,9.51 D3.A | v16.53,31.61 23,31.61 v23.07,31.68
WRN  (via drill 0.35)
  Top 0.203: R15.1 15.51,34.93 v16.2,35.61
  Bottom 0.203: v16.2,35.61 22.49,35.61 25.11,32.99 27.08,32.99 U3.11